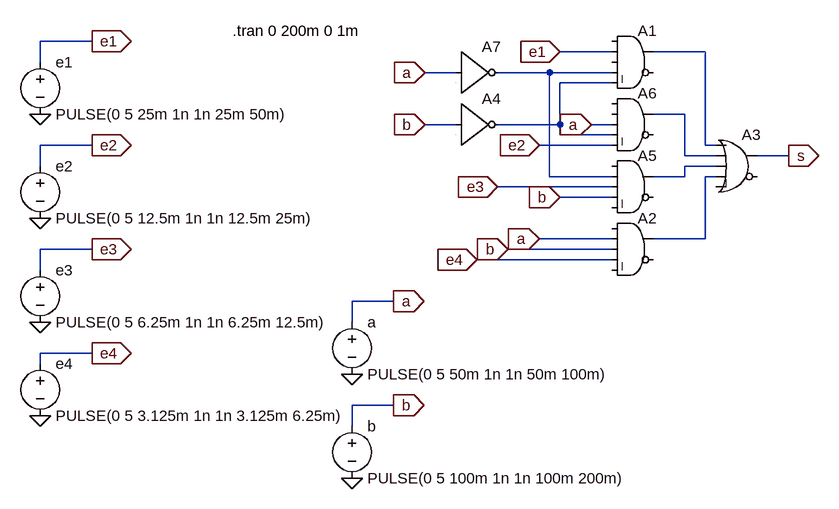
[diagram p0: schematic Mux.asc]
Mux.asc, the LTspice schematic file:
Version 4
SHEET 1 1172 752
WIRE 32 64 -48 64
WIRE 832 80 752 80
WIRE 976 80 896 80
WIRE -48 96 -48 64
WIRE 592 112 544 112
WIRE 736 112 656 112
WIRE 832 112 736 112
WIRE 832 128 752 128
WIRE 944 176 896 176
WIRE 592 192 544 192
WIRE 752 192 752 128
WIRE 752 192 656 192
WIRE 832 192 800 192
WIRE 752 208 752 192
WIRE 832 208 752 208
WIRE 32 224 -48 224
WIRE 832 224 720 224
WIRE 976 224 976 80
WIRE 992 224 976 224
WIRE 944 240 944 176
WIRE 992 240 944 240
WIRE 1104 240 1056 240
WIRE -48 256 -48 224
WIRE 992 256 944 256
WIRE 736 272 736 112
WIRE 832 272 736 272
WIRE 944 272 944 256
WIRE 944 272 896 272
WIRE 992 272 976 272
WIRE 832 288 656 288
WIRE 832 304 752 304
WIRE 832 368 720 368
WIRE 976 368 976 272
WIRE 976 368 896 368
WIRE 32 384 -48 384
WIRE 832 384 672 384
WIRE 832 400 624 400
WIRE -48 416 -48 384
WIRE 496 464 432 464
WIRE 432 496 432 464
WIRE 32 544 -48 544
WIRE -48 560 -48 544
WIRE 496 624 432 624
WIRE 432 656 432 624
FLAG -48 176 0
FLAG -48 336 0
FLAG -48 496 0
FLAG -48 640 0
FLAG 432 576 0
FLAG 432 736 0
FLAG 496 464 a
IOPIN 496 464 Out
FLAG 496 624 b
IOPIN 496 624 Out
FLAG 32 64 e1
IOPIN 32 64 Out
FLAG 32 224 e2
IOPIN 32 224 Out
FLAG 32 384 e3
IOPIN 32 384 Out
FLAG 32 544 e4
IOPIN 32 544 Out
FLAG 544 112 a
IOPIN 544 112 In
FLAG 544 192 b
IOPIN 544 192 In
FLAG 752 80 e1
IOPIN 752 80 In
FLAG 720 368 a
IOPIN 720 368 In
FLAG 672 384 b
IOPIN 672 384 In
FLAG 624 400 e4
IOPIN 624 400 In
FLAG 656 288 e3
IOPIN 656 288 In
FLAG 720 224 e2
IOPIN 720 224 In
FLAG 1104 240 s
IOPIN 1104 240 Out
FLAG 752 304 b
IOPIN 752 304 In
FLAG 800 192 a
IOPIN 800 192 In
SYMBOL and 864 32 R0
SYMATTR InstName A1
SYMBOL and 864 320 R0
SYMATTR InstName A2
SYMBOL or 1024 192 R0
SYMATTR InstName A3
SYMBOL inv 592 128 R0
SYMATTR InstName A4
SYMBOL and 864 224 R0
SYMATTR InstName A5
SYMBOL and 864 128 R0
SYMATTR InstName A6
SYMBOL inv 592 48 R0
SYMATTR InstName A7
SYMBOL voltage 432 480 R0
SYMATTR InstName a
SYMATTR Value PULSE(0 5 50m 1n 1n 50m 100m)
SYMBOL voltage 432 640 R0
SYMATTR InstName b
SYMATTR Value PULSE(0 5 100m 1n 1n 100m 200m)
SYMBOL voltage -48 80 R0
SYMATTR InstName e1
SYMATTR Value PULSE(0 5 25m 1n 1n 25m 50m)
SYMBOL voltage -48 240 R0
SYMATTR InstName e2
SYMATTR Value PULSE(0 5 12.5m 1n 1n 12.5m 25m)
SYMBOL voltage -48 400 R0
SYMATTR InstName e3
SYMATTR Value PULSE(0 5 6.25m 1n 1n 6.25m 12.5m)
SYMBOL voltage -48 544 R0
SYMATTR InstName e4
SYMATTR Value PULSE(0 5 3.125m 1n 1n 3.125m 6.25m)
TEXT 248 48 Left 2 !.tran 0 200m 0 1m

The netlist it stands for:
* Mux.asc
A1 0 e1 0 N002 N003 0 N001 0 AND
A2 0 a b e4 0 0 N006 0 AND
A3 N001 N004 N005 N006 0 0 s 0 OR
A4 b 0 0 0 0 N003 0 0 BUF
A5 0 N002 e3 b 0 0 N005 0 AND
A6 0 0 a N003 e2 0 N004 0 AND
A7 a 0 0 0 0 N002 0 0 BUF
V§a a 0 PULSE(0 5 50m 1n 1n 50m 100m)
V§b b 0 PULSE(0 5 100m 1n 1n 100m 200m)
V§e1 e1 0 PULSE(0 5 25m 1n 1n 25m 50m)
V§e2 e2 0 PULSE(0 5 12.5m 1n 1n 12.5m 25m)
V§e3 e3 0 PULSE(0 5 6.25m 1n 1n 6.25m 12.5m)
V§e4 e4 0 PULSE(0 5 3.125m 1n 1n 3.125m 6.25m)
.tran 0 200m 0 1m
.backanno
.end